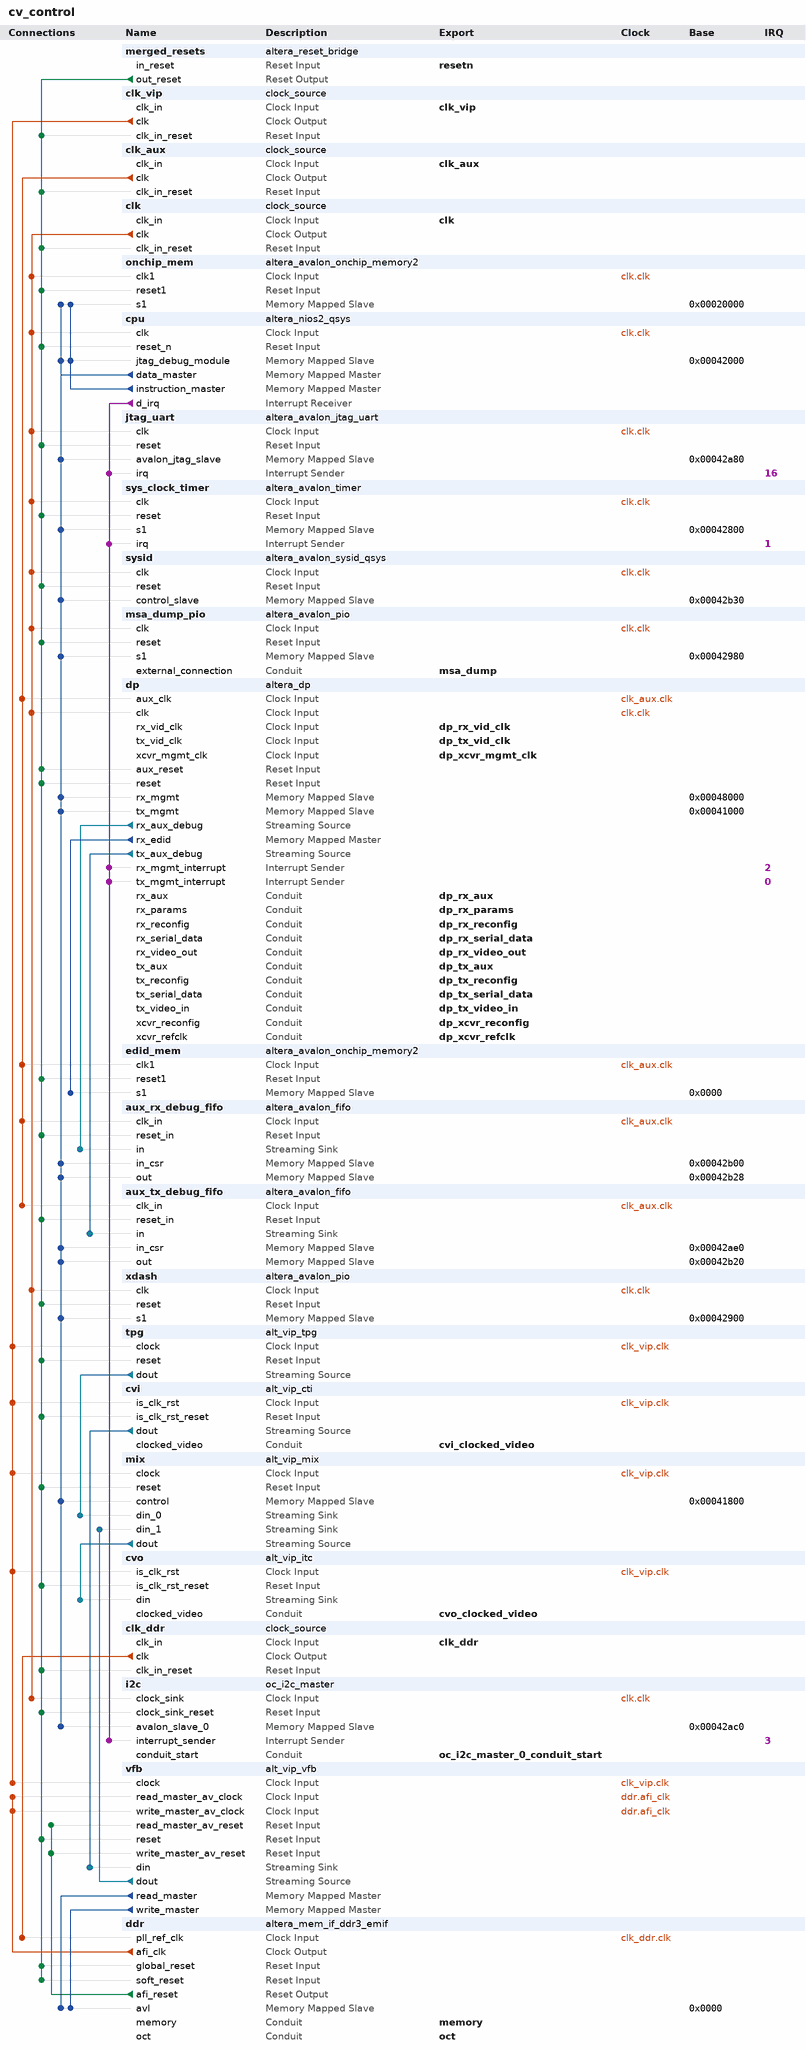
[diagram p0: system contents]
# Platform Designer (Qsys) system cv_control, Cyclone V Unknown
# Parameters at their usual value, and those the tool derives, are not listed.
package require -exact qsys 13.1
create_system cv_control
set_project_property DEVICE_FAMILY {Cyclone V}
set_project_property DEVICE Unknown

add_instance merged_resets altera_reset_bridge 13.1
set_instance_parameter_value merged_resets ACTIVE_LOW_RESET 1
set_instance_parameter_value merged_resets SYNCHRONOUS_EDGES none

add_instance clk_vip clock_source 13.1
set_instance_parameter_value clk_vip clockFrequency 154000000

add_instance clk_aux clock_source 13.1
set_instance_parameter_value clk_aux clockFrequency 16000000

add_instance clk clock_source 13.1
set_instance_parameter_value clk clockFrequency 100000000

add_instance onchip_mem altera_avalon_onchip_memory2 13.1
set_instance_parameter_value onchip_mem dataWidth 32
set_instance_parameter_value onchip_mem dualPort false
set_instance_parameter_value onchip_mem initMemContent true
set_instance_parameter_value onchip_mem initializationFileName onchip_mem
set_instance_parameter_value onchip_mem memorySize 67584

add_instance cpu altera_nios2_qsys 13.1
set_instance_parameter_value cpu resetSlave onchip_mem.s1
set_instance_parameter_value cpu exceptionSlave onchip_mem.s1
set_instance_parameter_value cpu breakSlave cpu.jtag_debug_module
set_instance_parameter_value cpu muldiv_multiplierType NoneSmall
set_instance_parameter_value cpu impl Tiny
set_instance_parameter_value cpu icache_size 2048

add_instance jtag_uart altera_avalon_jtag_uart 13.1
set_instance_parameter_value jtag_uart readBufferDepth 1024
set_instance_parameter_value jtag_uart readIRQThreshold 1
set_instance_parameter_value jtag_uart simInteractiveOptions INTERACTIVE_ASCII_OUTPUT
set_instance_parameter_value jtag_uart writeBufferDepth 1024
set_instance_parameter_value jtag_uart writeIRQThreshold 1

add_instance sys_clock_timer altera_avalon_timer 13.1
set_instance_parameter_value sys_clock_timer period 1
set_instance_parameter_value sys_clock_timer periodUnits MSEC

add_instance sysid altera_avalon_sysid_qsys 13.1
set_instance_parameter_value sysid id 0

add_instance msa_dump_pio altera_avalon_pio 13.1
set_instance_parameter_value msa_dump_pio direction Input
set_instance_parameter_value msa_dump_pio width 1

add_instance dp altera_dp 13.1
set_instance_parameter_value dp device_family {Cyclone V}
set_instance_parameter_value dp TX_SUPPORT_SS 0
set_instance_parameter_value dp TX_SUPPORT_AUDIO 0
set_instance_parameter_value dp TX_AUDIO_CHANS 2
set_instance_parameter_value dp TX_VIDEO_BPS 8
set_instance_parameter_value dp TX_MAX_LINK_RATE 10
set_instance_parameter_value dp RX_IMAGE_OUT_FORMAT 1
set_instance_parameter_value dp TX_MAX_LANE_COUNT 4
set_instance_parameter_value dp TX_POLINV 0
set_instance_parameter_value dp TX_SUPPORT_ANALOG_RECONFIG 0
set_instance_parameter_value dp TX_AUX_DEBUG 1
set_instance_parameter_value dp TX_SCRAMBLER_SEED 65535
set_instance_parameter_value dp TX_PIXELS_PER_CLOCK 1
set_instance_parameter_value dp TX_SYMBOLS_PER_CLOCK 2
set_instance_parameter_value dp TX_IMPORT_MSA 0
set_instance_parameter_value dp TX_INTERLACED_VID 0
set_instance_parameter_value dp TX_SUPPORT_18BPP 1
set_instance_parameter_value dp TX_SUPPORT_24BPP 1
set_instance_parameter_value dp TX_SUPPORT_30BPP 0
set_instance_parameter_value dp TX_SUPPORT_36BPP 0
set_instance_parameter_value dp TX_SUPPORT_48BPP 0
set_instance_parameter_value dp TX_SUPPORT_YCBCR422_16BPP 0
set_instance_parameter_value dp TX_SUPPORT_YCBCR422_20BPP 0
set_instance_parameter_value dp TX_SUPPORT_YCBCR422_24BPP 0
set_instance_parameter_value dp TX_SUPPORT_YCBCR422_32BPP 0
set_instance_parameter_value dp TX_SUPPORT_DP 1
set_instance_parameter_value dp TX_SUPPORT_AUTOMATED_TEST 1
set_instance_parameter_value dp RX_PIXELS_PER_CLOCK 1
set_instance_parameter_value dp RX_SYMBOLS_PER_CLOCK 2
set_instance_parameter_value dp RX_EXPORT_MSA 0
set_instance_parameter_value dp RX_VIDEO_BPS 8
set_instance_parameter_value dp RX_SUPPORT_SS 0
set_instance_parameter_value dp RX_SUPPORT_AUDIO 0
set_instance_parameter_value dp RX_AUDIO_CHANS 2
set_instance_parameter_value dp RX_MAX_LINK_RATE 10
set_instance_parameter_value dp RX_MAX_LANE_COUNT 4
set_instance_parameter_value dp RX_POLINV 1
set_instance_parameter_value dp RX_SCRAMBLER_SEED 65535
set_instance_parameter_value dp RX_SUPPORT_AUTOMATED_TEST 1
set_instance_parameter_value dp RX_SUPPORT_18BPP 1
set_instance_parameter_value dp RX_SUPPORT_24BPP 1
set_instance_parameter_value dp RX_SUPPORT_30BPP 0
set_instance_parameter_value dp RX_SUPPORT_36BPP 0
set_instance_parameter_value dp RX_SUPPORT_48BPP 0
set_instance_parameter_value dp RX_SUPPORT_YCBCR422_16BPP 0
set_instance_parameter_value dp RX_SUPPORT_YCBCR422_20BPP 0
set_instance_parameter_value dp RX_SUPPORT_YCBCR422_24BPP 0
set_instance_parameter_value dp RX_SUPPORT_YCBCR422_32BPP 0
set_instance_parameter_value dp RX_SUPPORT_DP 1
set_instance_parameter_value dp RX_AUX_DEBUG 1
set_instance_parameter_value dp RX_IEEE_OUI 1
set_instance_parameter_value dp RX_AUX_GPU 0

add_instance edid_mem altera_avalon_onchip_memory2 13.1
set_instance_parameter_value edid_mem allowInSystemMemoryContentEditor true
set_instance_parameter_value edid_mem dataWidth 8
set_instance_parameter_value edid_mem dualPort false
set_instance_parameter_value edid_mem initMemContent true
set_instance_parameter_value edid_mem initializationFileName edid_memory
set_instance_parameter_value edid_mem instanceID EDID
set_instance_parameter_value edid_mem memorySize 256
set_instance_parameter_value edid_mem useNonDefaultInitFile true

add_instance aux_rx_debug_fifo altera_avalon_fifo 13.1
set_instance_parameter_value aux_rx_debug_fifo bitsPerSymbol 32
set_instance_parameter_value aux_rx_debug_fifo channelWidth 1
set_instance_parameter_value aux_rx_debug_fifo errorWidth 1
set_instance_parameter_value aux_rx_debug_fifo fifoDepth 2048
set_instance_parameter_value aux_rx_debug_fifo fifoInputInterfaceOptions AVALONST_SINK
set_instance_parameter_value aux_rx_debug_fifo fifoOutputInterfaceOptions AVALONMM_READ
set_instance_parameter_value aux_rx_debug_fifo singleClockMode true
set_instance_parameter_value aux_rx_debug_fifo symbolsPerBeat 1
set_instance_parameter_value aux_rx_debug_fifo useBackpressure false
set_instance_parameter_value aux_rx_debug_fifo useIRQ false
set_instance_parameter_value aux_rx_debug_fifo usePacket true
set_instance_parameter_value aux_rx_debug_fifo useReadControl false

add_instance aux_tx_debug_fifo altera_avalon_fifo 13.1
set_instance_parameter_value aux_tx_debug_fifo bitsPerSymbol 32
set_instance_parameter_value aux_tx_debug_fifo channelWidth 1
set_instance_parameter_value aux_tx_debug_fifo errorWidth 1
set_instance_parameter_value aux_tx_debug_fifo fifoDepth 2048
set_instance_parameter_value aux_tx_debug_fifo fifoInputInterfaceOptions AVALONST_SINK
set_instance_parameter_value aux_tx_debug_fifo fifoOutputInterfaceOptions AVALONMM_READ
set_instance_parameter_value aux_tx_debug_fifo singleClockMode true
set_instance_parameter_value aux_tx_debug_fifo symbolsPerBeat 1
set_instance_parameter_value aux_tx_debug_fifo useBackpressure false
set_instance_parameter_value aux_tx_debug_fifo useIRQ false
set_instance_parameter_value aux_tx_debug_fifo usePacket true
set_instance_parameter_value aux_tx_debug_fifo useReadControl false

add_instance xdash altera_avalon_pio 13.1
set_instance_parameter_value xdash direction Output
set_instance_parameter_value xdash width 32

add_instance tpg alt_vip_tpg 13.0
set_instance_parameter_value tpg CHANNELS_IN_PAR 3
set_instance_parameter_value tpg CTRL_INTERFACE_DEPTH 10
set_instance_parameter_value tpg PARAMETERISATION {<testPatternGeneratorParams><TPG_NAME>MyPatternGenerator</TPG_NAME><TPG_RUNTIME_CONTROL>0</TPG_RUNTIME_CONTROL><TPG_BPS>8</TPG_BPS><TPG_MAX_WIDTH>1920</TPG_MAX_WIDTH><TPG_MAX_HEIGHT>1200</TPG_MAX_HEIGHT><TPG_COLORSPACE>COLORSPACE_RGB</TPG_COLORSPACE><TPG_FORMAT>SAMPLE_444</TPG_FORMAT><TPG_INTERLACE>PROGRESSIVE_FRAMES</TPG_INTERLACE><TPG_PARALLEL_MODE>true</TPG_PARALLEL_MODE><TPG_PATTERN>TPG_PATTERN_COLORBARS</TPG_PATTERN><TPG_UNIFORM_VAL_C1>128</TPG_UNIFORM_VAL_C1><TPG_UNIFORM_VAL_C2>128</TPG_UNIFORM_VAL_C2><TPG_UNIFORM_VAL_C3>128</TPG_UNIFORM_VAL_C3></testPatternGeneratorParams>}

add_instance cvi alt_vip_cti 13.0
set_instance_parameter_value cvi FAMILY {Cyclone V}
set_instance_parameter_value cvi BPS 8
set_instance_parameter_value cvi NUMBER_OF_COLOUR_PLANES 3
set_instance_parameter_value cvi COLOUR_PLANES_ARE_IN_PARALLEL 1
set_instance_parameter_value cvi SYNC_TO 0
set_instance_parameter_value cvi USE_EMBEDDED_SYNCS 0
set_instance_parameter_value cvi ADD_DATA_ENABLE_SIGNAL 1
set_instance_parameter_value cvi ACCEPT_COLOURS_IN_SEQ 0
set_instance_parameter_value cvi USE_STD 0
set_instance_parameter_value cvi STD_WIDTH 1
set_instance_parameter_value cvi GENERATE_ANC 0
set_instance_parameter_value cvi INTERLACED 0
set_instance_parameter_value cvi H_ACTIVE_PIXELS_F0 1920
set_instance_parameter_value cvi V_ACTIVE_LINES_F0 1080
set_instance_parameter_value cvi V_ACTIVE_LINES_F1 480
set_instance_parameter_value cvi FIFO_DEPTH 1920
set_instance_parameter_value cvi CLOCKS_ARE_SAME 0
set_instance_parameter_value cvi USE_CONTROL 0
set_instance_parameter_value cvi GENERATE_SYNC 0

add_instance mix alt_vip_mix 13.0
set_instance_parameter_value mix PARAMETERISATION {<mixerParams><MIX_NAME>mixer</MIX_NAME><MIX_ALPHA_ENABLED>false</MIX_ALPHA_ENABLED><MIX_ALPHA_BPS>8</MIX_ALPHA_BPS><MIX_CHANNELS_IN_SEQ>1</MIX_CHANNELS_IN_SEQ><MIX_CHANNELS_IN_PAR>3</MIX_CHANNELS_IN_PAR><MIX_BPS>8</MIX_BPS><MIX_NUM_LAYERS>2</MIX_NUM_LAYERS><MIX_RUNTIME_MAX_WIDTH>1920</MIX_RUNTIME_MAX_WIDTH><MIX_RUNTIME_MAX_HEIGHT>1200</MIX_RUNTIME_MAX_HEIGHT></mixerParams>}

add_instance cvo alt_vip_itc 13.0
set_instance_parameter_value cvo NUMBER_OF_COLOUR_PLANES 3
set_instance_parameter_value cvo H_ACTIVE_PIXELS 1920
set_instance_parameter_value cvo V_ACTIVE_LINES 1200
set_instance_parameter_value cvo FIFO_DEPTH 1920
set_instance_parameter_value cvo THRESHOLD 1919
set_instance_parameter_value cvo H_SYNC_LENGTH 32
set_instance_parameter_value cvo H_FRONT_PORCH 48
set_instance_parameter_value cvo H_BACK_PORCH 80
set_instance_parameter_value cvo V_SYNC_LENGTH 6
set_instance_parameter_value cvo V_FRONT_PORCH 3
set_instance_parameter_value cvo V_BACK_PORCH 26

add_instance clk_ddr clock_source 13.1
set_instance_parameter_value clk_ddr clockFrequency 100000000

add_instance i2c oc_i2c_master 1.0

add_instance vfb alt_vip_vfb 13.0

add_instance ddr altera_mem_if_ddr3_emif 13.1
set_instance_parameter_value ddr MEM_VENDOR Micron
set_instance_parameter_value ddr MEM_FORMAT DISCRETE
set_instance_parameter_value ddr MEM_CLK_FREQ_MAX 533.333
set_instance_parameter_value ddr MEM_ROW_ADDR_WIDTH 14
set_instance_parameter_value ddr MEM_COL_ADDR_WIDTH 10
set_instance_parameter_value ddr MEM_DQ_WIDTH 64
set_instance_parameter_value ddr MEM_BANKADDR_WIDTH 3
set_instance_parameter_value ddr MEM_DRV_STR RZQ/6
set_instance_parameter_value ddr MEM_RTT_NOM RZQ/4
set_instance_parameter_value ddr MEM_RTT_WR {Dynamic ODT off}
set_instance_parameter_value ddr MEM_WTCL 5
set_instance_parameter_value ddr MEM_TCL 6
set_instance_parameter_value ddr TIMING_TIS 190
set_instance_parameter_value ddr TIMING_TIH 140
set_instance_parameter_value ddr TIMING_TDS 30
set_instance_parameter_value ddr TIMING_TDH 65
set_instance_parameter_value ddr TIMING_TDQSQ 125
set_instance_parameter_value ddr TIMING_TDQSCK 255
set_instance_parameter_value ddr TIMING_TDQSS 0.25
set_instance_parameter_value ddr TIMING_TQSH 0.4
set_instance_parameter_value ddr TIMING_TDSH 0.2
set_instance_parameter_value ddr TIMING_TDSS 0.2
set_instance_parameter_value ddr MEM_TRAS_NS 36.0
set_instance_parameter_value ddr MEM_TRCD_NS 13.5
set_instance_parameter_value ddr MEM_TRP_NS 13.5
set_instance_parameter_value ddr MEM_TRFC_NS 160.0
set_instance_parameter_value ddr MEM_TWTR 5
set_instance_parameter_value ddr MEM_TFAW_NS 45.0
set_instance_parameter_value ddr MEM_TRRD_NS 7.5
set_instance_parameter_value ddr MEM_TRTP_NS 7.5
set_instance_parameter_value ddr RATE Half
set_instance_parameter_value ddr MEM_CLK_FREQ 300.0
set_instance_parameter_value ddr SPEED_GRADE 7
set_instance_parameter_value ddr HARD_EMIF false
set_instance_parameter_value ddr POWER_OF_TWO_BUS true
set_instance_parameter_value ddr SOPC_COMPAT_RESET true
set_instance_parameter_value ddr AVL_MAX_SIZE 8
set_instance_parameter_value ddr CFG_REORDER_DATA false
set_instance_parameter_value ddr PRIORITY_PORT 1,1,1,1,1,1
set_instance_parameter_value ddr CPORT_TYPE_PORT Bidirectional,Bidirectional,Bidirectional,Bidirectional,Bidirectional,Bidirectional
set_instance_parameter_value ddr REF_CLK_FREQ 100.0
set_instance_parameter_value ddr DEFAULT_FAST_SIM_MODEL true
set_instance_parameter_value ddr EXPORT_AFI_HALF_CLK false
set_instance_parameter_value ddr PLL_LOCATION Top_Bottom
set_instance_parameter_value ddr CALIBRATION_MODE Skip
set_instance_parameter_value ddr USER_DEBUG_LEVEL 0
set_instance_parameter_value ddr TIMING_BOARD_MAX_CK_DELAY 0.6
set_instance_parameter_value ddr TIMING_BOARD_MAX_DQS_DELAY 0.6
set_instance_parameter_value ddr TIMING_BOARD_SKEW_CKDQS_DIMM_MIN -0.01
set_instance_parameter_value ddr TIMING_BOARD_SKEW_CKDQS_DIMM_MAX 0.01
set_instance_parameter_value ddr TIMING_BOARD_SKEW_WITHIN_DQS 0.02
set_instance_parameter_value ddr TIMING_BOARD_SKEW_BETWEEN_DQS 0.02
set_instance_parameter_value ddr TIMING_BOARD_DQ_TO_DQS_SKEW 0.0
set_instance_parameter_value ddr TIMING_BOARD_AC_SKEW 0.02
set_instance_parameter_value ddr TIMING_BOARD_AC_TO_CK_SKEW 0.0

# connections
add_connection clk.clk cpu.clk clock
add_connection clk.clk dp.clk clock
add_connection clk.clk i2c.clock_sink clock
add_connection clk.clk jtag_uart.clk clock
add_connection clk.clk msa_dump_pio.clk clock
add_connection clk.clk onchip_mem.clk1 clock
add_connection clk.clk sys_clock_timer.clk clock
add_connection clk.clk sysid.clk clock
add_connection clk.clk xdash.clk clock
add_connection clk_aux.clk aux_rx_debug_fifo.clk_in clock
add_connection clk_aux.clk aux_tx_debug_fifo.clk_in clock
add_connection clk_aux.clk dp.aux_clk clock
add_connection clk_aux.clk edid_mem.clk1 clock
add_connection clk_ddr.clk ddr.pll_ref_clk clock
add_connection clk_vip.clk cvi.is_clk_rst clock
add_connection clk_vip.clk cvo.is_clk_rst clock
add_connection clk_vip.clk mix.clock clock
add_connection clk_vip.clk tpg.clock clock
add_connection clk_vip.clk vfb.clock clock
add_connection ddr.afi_clk vfb.read_master_av_clock clock
add_connection ddr.afi_clk vfb.write_master_av_clock clock
add_connection ddr.afi_reset vfb.read_master_av_reset reset
add_connection ddr.afi_reset vfb.write_master_av_reset reset
add_connection merged_resets.out_reset aux_rx_debug_fifo.reset_in reset
add_connection merged_resets.out_reset aux_tx_debug_fifo.reset_in reset
add_connection merged_resets.out_reset clk.clk_in_reset reset
add_connection merged_resets.out_reset clk_aux.clk_in_reset reset
add_connection merged_resets.out_reset clk_ddr.clk_in_reset reset
add_connection merged_resets.out_reset clk_vip.clk_in_reset reset
add_connection merged_resets.out_reset cpu.reset_n reset
add_connection merged_resets.out_reset cvi.is_clk_rst_reset reset
add_connection merged_resets.out_reset cvo.is_clk_rst_reset reset
add_connection merged_resets.out_reset ddr.global_reset reset
add_connection merged_resets.out_reset ddr.soft_reset reset
add_connection merged_resets.out_reset dp.aux_reset reset
add_connection merged_resets.out_reset dp.reset reset
add_connection merged_resets.out_reset edid_mem.reset1 reset
add_connection merged_resets.out_reset i2c.clock_sink_reset reset
add_connection merged_resets.out_reset jtag_uart.reset reset
add_connection merged_resets.out_reset mix.reset reset
add_connection merged_resets.out_reset msa_dump_pio.reset reset
add_connection merged_resets.out_reset onchip_mem.reset1 reset
add_connection merged_resets.out_reset sys_clock_timer.reset reset
add_connection merged_resets.out_reset sysid.reset reset
add_connection merged_resets.out_reset tpg.reset reset
add_connection merged_resets.out_reset vfb.reset reset
add_connection merged_resets.out_reset xdash.reset reset
add_connection cpu.data_master aux_rx_debug_fifo.in_csr avalon
set_connection_parameter_value cpu.data_master/aux_rx_debug_fifo.in_csr baseAddress 0x00042b00
add_connection cpu.data_master aux_rx_debug_fifo.out avalon
set_connection_parameter_value cpu.data_master/aux_rx_debug_fifo.out baseAddress 0x00042b28
add_connection cpu.data_master aux_tx_debug_fifo.in_csr avalon
set_connection_parameter_value cpu.data_master/aux_tx_debug_fifo.in_csr baseAddress 0x00042ae0
add_connection cpu.data_master aux_tx_debug_fifo.out avalon
set_connection_parameter_value cpu.data_master/aux_tx_debug_fifo.out baseAddress 0x00042b20
add_connection cpu.data_master cpu.jtag_debug_module avalon
set_connection_parameter_value cpu.data_master/cpu.jtag_debug_module baseAddress 0x00042000
add_connection cpu.data_master dp.rx_mgmt avalon
set_connection_parameter_value cpu.data_master/dp.rx_mgmt baseAddress 0x00048000
add_connection cpu.data_master dp.tx_mgmt avalon
set_connection_parameter_value cpu.data_master/dp.tx_mgmt baseAddress 0x00041000
add_connection cpu.data_master i2c.avalon_slave_0 avalon
set_connection_parameter_value cpu.data_master/i2c.avalon_slave_0 baseAddress 0x00042ac0
add_connection cpu.data_master jtag_uart.avalon_jtag_slave avalon
set_connection_parameter_value cpu.data_master/jtag_uart.avalon_jtag_slave baseAddress 0x00042a80
add_connection cpu.data_master mix.control avalon
set_connection_parameter_value cpu.data_master/mix.control baseAddress 0x00041800
add_connection cpu.data_master msa_dump_pio.s1 avalon
set_connection_parameter_value cpu.data_master/msa_dump_pio.s1 baseAddress 0x00042980
add_connection cpu.data_master onchip_mem.s1 avalon
set_connection_parameter_value cpu.data_master/onchip_mem.s1 baseAddress 0x00020000
add_connection cpu.data_master sys_clock_timer.s1 avalon
set_connection_parameter_value cpu.data_master/sys_clock_timer.s1 baseAddress 0x00042800
add_connection cpu.data_master sysid.control_slave avalon
set_connection_parameter_value cpu.data_master/sysid.control_slave baseAddress 0x00042b30
add_connection cpu.data_master xdash.s1 avalon
set_connection_parameter_value cpu.data_master/xdash.s1 baseAddress 0x00042900
add_connection cpu.instruction_master cpu.jtag_debug_module avalon
set_connection_parameter_value cpu.instruction_master/cpu.jtag_debug_module baseAddress 0x00042000
add_connection cpu.instruction_master onchip_mem.s1 avalon
set_connection_parameter_value cpu.instruction_master/onchip_mem.s1 baseAddress 0x00020000
add_connection dp.rx_edid edid_mem.s1 avalon
set_connection_parameter_value dp.rx_edid/edid_mem.s1 baseAddress 0x0000
add_connection vfb.read_master ddr.avl avalon
set_connection_parameter_value vfb.read_master/ddr.avl baseAddress 0x0000
add_connection vfb.write_master ddr.avl avalon
set_connection_parameter_value vfb.write_master/ddr.avl baseAddress 0x0000
add_connection cvi.dout vfb.din avalon_streaming
add_connection dp.rx_aux_debug aux_rx_debug_fifo.in avalon_streaming
add_connection dp.tx_aux_debug aux_tx_debug_fifo.in avalon_streaming
add_connection mix.dout cvo.din avalon_streaming
add_connection tpg.dout mix.din_0 avalon_streaming
add_connection vfb.dout mix.din_1 avalon_streaming
add_connection cpu.d_irq dp.rx_mgmt_interrupt interrupt
set_connection_parameter_value cpu.d_irq/dp.rx_mgmt_interrupt irqNumber 2
add_connection cpu.d_irq dp.tx_mgmt_interrupt interrupt
set_connection_parameter_value cpu.d_irq/dp.tx_mgmt_interrupt irqNumber 0
add_connection cpu.d_irq i2c.interrupt_sender interrupt
set_connection_parameter_value cpu.d_irq/i2c.interrupt_sender irqNumber 3
add_connection cpu.d_irq jtag_uart.irq interrupt
set_connection_parameter_value cpu.d_irq/jtag_uart.irq irqNumber 16
add_connection cpu.d_irq sys_clock_timer.irq interrupt
set_connection_parameter_value cpu.d_irq/sys_clock_timer.irq irqNumber 1

# exported interfaces
add_interface clk clock sink
set_interface_property clk EXPORT_OF clk.clk_in
add_interface clk_vip clock sink
set_interface_property clk_vip EXPORT_OF clk_vip.clk_in
add_interface clk_aux clock sink
set_interface_property clk_aux EXPORT_OF clk_aux.clk_in
add_interface resetn reset sink
set_interface_property resetn EXPORT_OF merged_resets.in_reset
add_interface dp_tx_aux conduit end
set_interface_property dp_tx_aux EXPORT_OF dp.tx_aux
add_interface dp_tx_video_in conduit end
set_interface_property dp_tx_video_in EXPORT_OF dp.tx_video_in
add_interface dp_rx_aux conduit end
set_interface_property dp_rx_aux EXPORT_OF dp.rx_aux
add_interface dp_xcvr_refclk conduit end
set_interface_property dp_xcvr_refclk EXPORT_OF dp.xcvr_refclk
add_interface dp_tx_serial_data conduit end
set_interface_property dp_tx_serial_data EXPORT_OF dp.tx_serial_data
add_interface dp_rx_serial_data conduit end
set_interface_property dp_rx_serial_data EXPORT_OF dp.rx_serial_data
add_interface dp_rx_params conduit end
set_interface_property dp_rx_params EXPORT_OF dp.rx_params
add_interface cvo_clocked_video conduit end
set_interface_property cvo_clocked_video EXPORT_OF cvo.clocked_video
add_interface msa_dump conduit end
set_interface_property msa_dump EXPORT_OF msa_dump_pio.external_connection
add_interface clk_ddr clock sink
set_interface_property clk_ddr EXPORT_OF clk_ddr.clk_in
add_interface oc_i2c_master_0_conduit_start conduit end
set_interface_property oc_i2c_master_0_conduit_start EXPORT_OF i2c.conduit_start
add_interface dp_xcvr_mgmt_clk clock sink
set_interface_property dp_xcvr_mgmt_clk EXPORT_OF dp.xcvr_mgmt_clk
add_interface dp_tx_reconfig conduit end
set_interface_property dp_tx_reconfig EXPORT_OF dp.tx_reconfig
add_interface dp_rx_reconfig conduit end
set_interface_property dp_rx_reconfig EXPORT_OF dp.rx_reconfig
add_interface dp_xcvr_reconfig conduit end
set_interface_property dp_xcvr_reconfig EXPORT_OF dp.xcvr_reconfig
add_interface dp_tx_vid_clk clock sink
set_interface_property dp_tx_vid_clk EXPORT_OF dp.tx_vid_clk
add_interface dp_rx_video_out conduit end
set_interface_property dp_rx_video_out EXPORT_OF dp.rx_video_out
add_interface dp_rx_vid_clk clock sink
set_interface_property dp_rx_vid_clk EXPORT_OF dp.rx_vid_clk
add_interface cvi_clocked_video conduit end
set_interface_property cvi_clocked_video EXPORT_OF cvi.clocked_video
add_interface memory conduit end
set_interface_property memory EXPORT_OF ddr.memory
add_interface oct conduit end
set_interface_property oct EXPORT_OF ddr.oct

set_interconnect_requirement {$system} qsys_mm.clockCrossingAdapter HANDSHAKE
set_interconnect_requirement {$system} qsys_mm.maxAdditionalLatency 1

save_system cv_control.qsys
